# EAGLE design GBP USB-C Charging Kit (EAGLE 6.2)
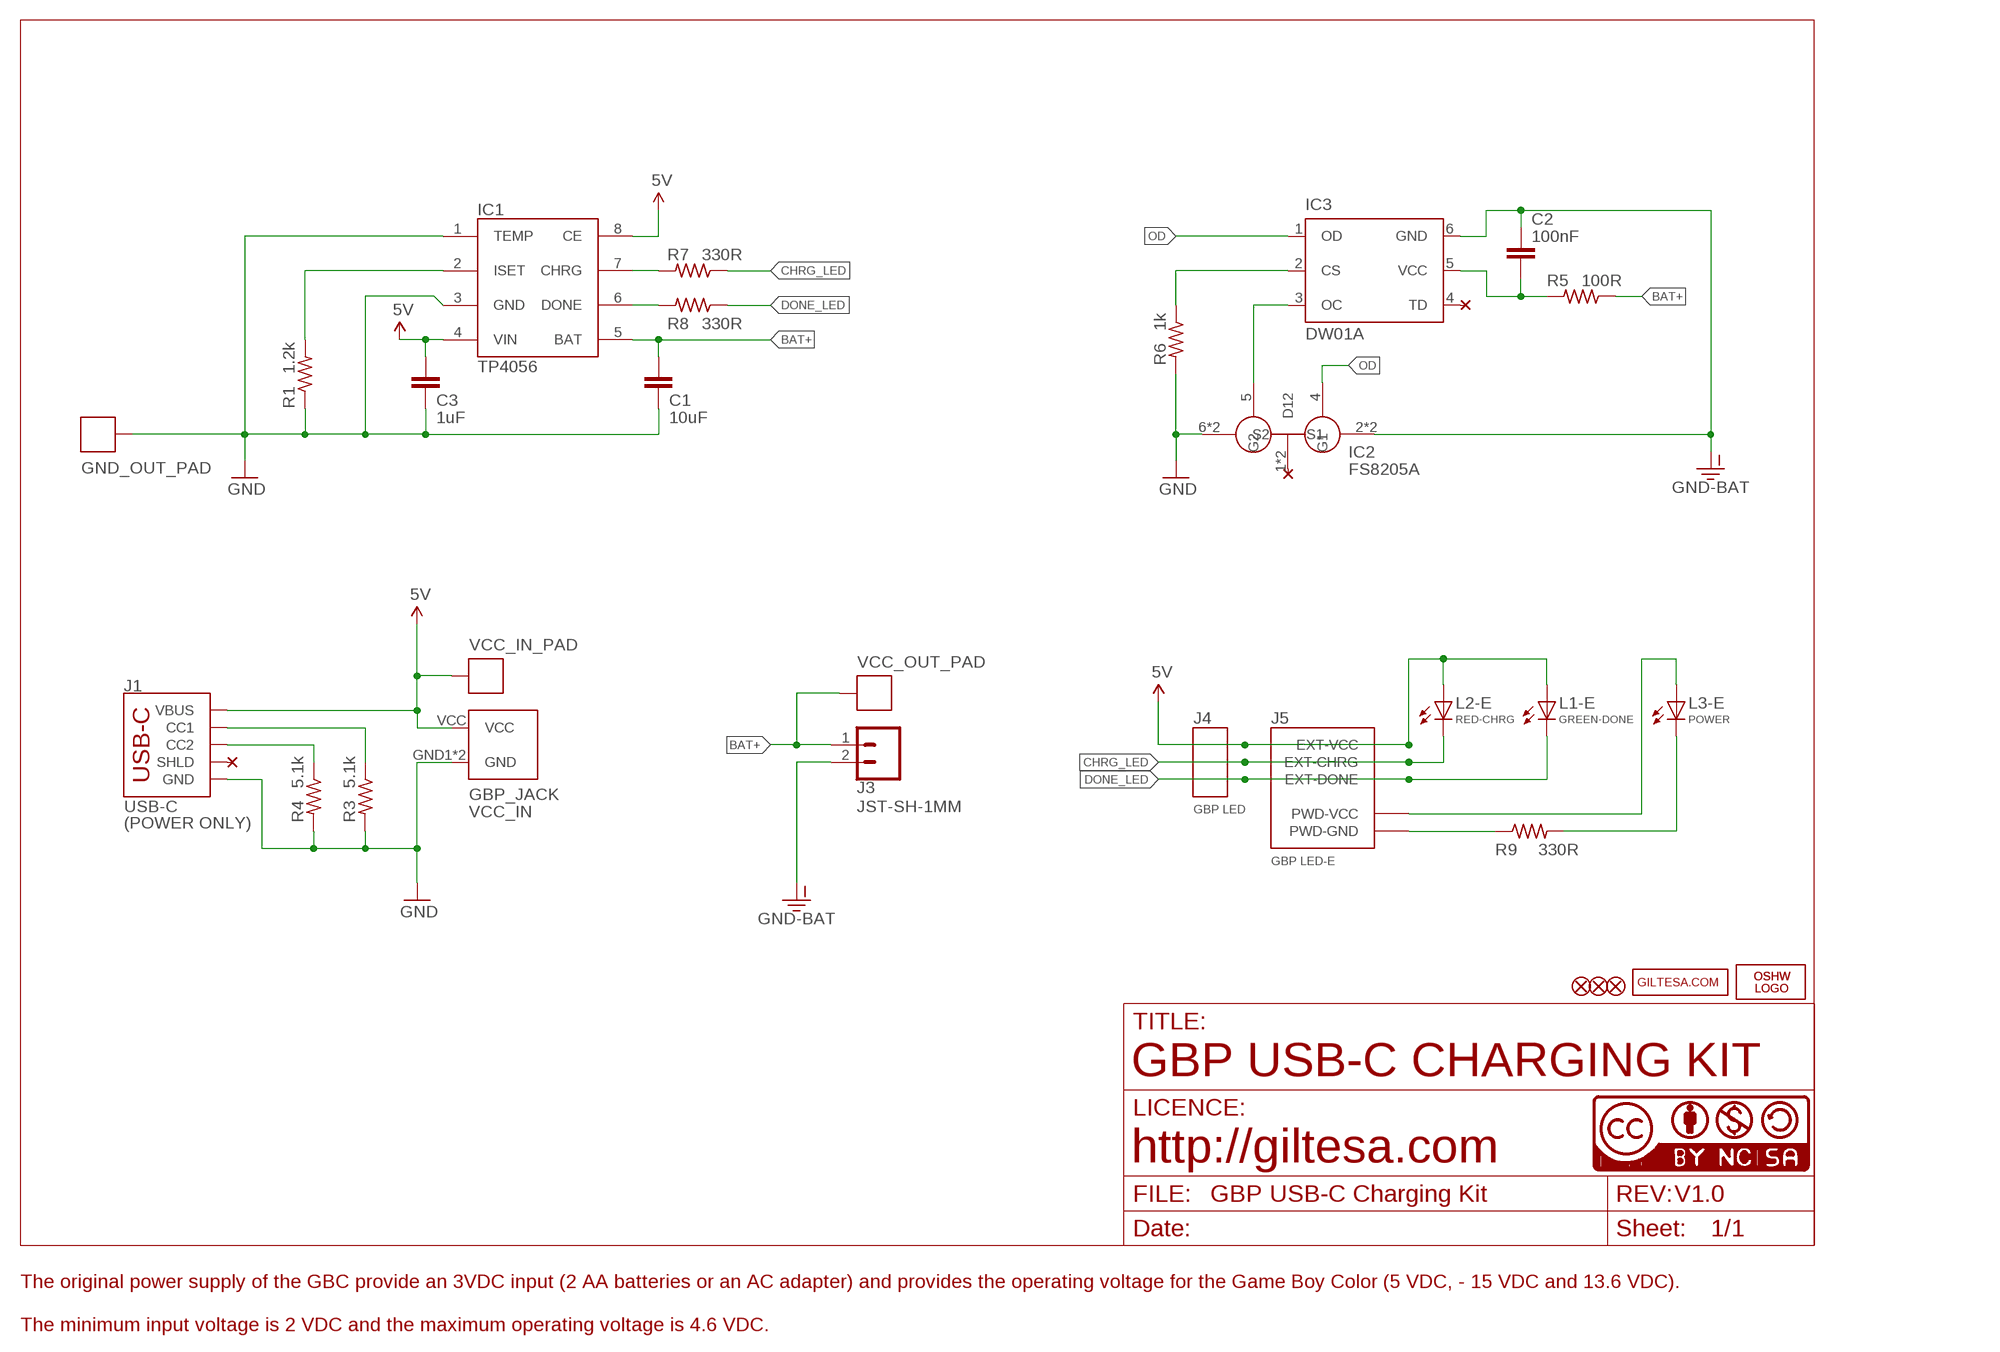
[diagram p0: schematic, sheet 1]

## Parts
C1  10uF  C0805  [C0805]
C2  100nF  C0603  [C0603]
C3  1uF  C0603  [C0603]
FD2  FIDUCIALUFIDUCIAL  [FIDUCIAL-MICRO]
FD3  FIDUCIALUFIDUCIAL  [FIDUCIAL-MICRO]
FD4  FIDUCIALUFIDUCIAL  [FIDUCIAL-MICRO]
GBP_JACK  VCC_IN  GBP_POWER_JACK  [GBP_POWER_JACK]
GND_OUT_PAD  1X01_SMT_1.8MM_2  [1X01_SMT_1.8MM_2]
IC1  TP4056  DIO5158  [SOIC-8]
IC2  8205A  FS8205A  [TSSOP8]
IC3  DW01A  DW01-P  [SOT23-6L]
J1  USB-C  USB-CPOWER  [USB-C_6P]
J3  JST-SH-1MM  JST-21MM  [JST-2-1MM-SMD_RIGHT]
J4  GBP LED  1X032  [1X03_SMD_2]
J5  GBP LED-E  GBP_LED  [GBP_LED]
L1-E  GREEN-DONE  L0402  [L0402]
L2-E  RED-CHRG  L0402  [L0402]
L3-E  POWER  L0402  [L0402]
LOGO1  OSHW_LOGO_FILLX0150-NT  [OSHW_FILLX150_NOTEXT]
LOGO2  OSHW_LOGO_FILLX0150-NT  [OSHW_FILLX150_NOTEXT]
R1  1.2k  R0402  [R0402]
R3  5.1k  R0402  [R0402]
R4  5.1k  R0402  [R0402]
R5  100R  R0402  [R0402]
R6  1k  R0402  [R0402]
R7  330R  R0402  [R0402]
R8  330R  R0402  [R0402]
R9  330R  R0402  [R0402]
U$6  CC-BY-NC-SA15MM  [CC-BY-NC-SA_15MM]
U$16  GILTESA.COM_MASK  [GILTESA.COM_MASK]
U$17  CC-NC-BCNIX  [CC-NC-B_NIX]
VCC_IN_PAD  1X01_SMT_1.8MM_3  [1X01_SMT_1.8MM_3]
VCC_OUT_PAD  1X01_SMT_1.8MM_3  [1X01_SMT_1.8MM_3]

## Nets
5V: C3.1 GBP_JACK.VCC IC1.4(VIN) IC1.8(CE) J1.VBUS1(VBUS) J1.VBUS2(VBUS) J4.3 J5.EXT-VCC L1-E.A L2-E.A VCC_IN_PAD.P$1
BAT+: C1.1 IC1.5(BAT) J3.1 R5.1 VCC_OUT_PAD.P$1
CHRG: IC1.7(CHRG) R7.2
CHRG_LED: J4.2 J5.EXT-CHRG L2-E.C R7.1
DONE: IC1.6(DONE) R8.2
DONE_LED: J4.1 J5.EXT-DONE L1-E.C R8.1
GND: C1.2 C3.2 GBP_JACK.GND1(GND) GBP_JACK.GND2(GND) GND_OUT_PAD.P$1 IC1.1(TEMP) IC1.3(GND) IC2.6(S2) IC2.7(S2) J1.GND1(GND) J1.GND2(GND) R1.1 R3.2 R4.2 R6.2
GND-BAT: C2.1 IC2.2(S1) IC2.3(S1) IC3.6(GND) J3.2
ISET: IC1.2(ISET) R1.2
N$1: IC3.2(CS) R6.1
N$2: IC2.5(G2) IC3.3(OC)
N$4: J1.A5(CC1) R3.1
N$6: J1.B5(CC2) R4.1
N$11: L3-E.C R9.2
OD: IC2.4(G1) IC3.1(OD)
PWD-GND: J5.PWD-GND J5.PWD-GND'(PWD-GND) R9.1
PWD-VCC: J5.PWD-VCC J5.PWD-VCC'(PWD-VCC) L3-E.A
VCC-DW: C2.2 IC3.5(VCC) R5.2
Unconnected: IC2.1(D12) IC2.8(D12) IC3.4(TD) J1.SHLD1(SHLD) J1.SHLD2(SHLD) J1.SHLD3(SHLD) J1.SHLD4(SHLD) J1.SHLD5(SHLD) J1.SHLD6(SHLD) J1.SHLD7(SHLD) J1.SHLD8(SHLD)

## Notes on the sheet
- IC2
- FS8205A
- (POWER ONLY)
- GBP USB-C CHARGING KIT
- http://giltesa.com
- V1.0
- The original power supply of the GBC provide an 3VDC input (2 AA batteries or an AC adapter) and provides the operating voltage for the Game Boy Color (5 VDC, - 15 VDC and 13.6 VDC).
- The minimum input voltage is 2 VDC and the maximum operating voltage is 4.6 VDC.

## Library data of the parts
C1 = ,giltesa:C0805
C2 C3 = ,giltesa:C0603
FD2-FD4 = SparkFun-Aesthetics:FIDUCIAL: Fiducial Alignment Points Point-of-reference for pick-and-place machines and other optical instruments.
GBP_JACK = ,giltesa:GBP_POWER_JACK
GND_OUT_PAD VCC_IN_PAD VCC_OUT_PAD = ,giltesa:1X01
IC1 = ERADIONICA:DIO5158
IC2 = SparkFun:FS8205A
IC3 = lipo:DW01-P: One Cell Lithium-ion/Polymer Battery Protection IC The DW01-P battery protection IC is designed to protect lithium-ion/polymer battery from damage or degrading the lifetime due to overcharge, overdischarge, and/or overcurrent for one-cell lithium-ion/polymer battery powered systems, such as cellular phones. The ultra-small package and less required external components make it ideal to integrate the DW01-P into the limited space of battery pack. The accurate ±50mV overcharging detection voltage ensures safe and full utilization charging. The very low standby current drains little current from the cell while in storage.
J1 = ,giltesa:USB-C
J3 = ,giltesa:JST-2
J4 = ,giltesa:1X03
J5 = ,giltesa:GBP_LED
L1-E L2-E L3-E = ,giltesa:L0402
LOGO1 LOGO2 = ohw-logo:OSHW_LOGO_FILL
R1 R3-R9 = ,giltesa:R0402
U$6 = ,giltesa_logos:CC-BY-NC-SA
U$16 = ,giltesa_logos:GILTESA.COM
U$17 = cc-by-nc-sa:CC-NC-BC: All hardware is licensed under the Creative Commons Attribution-Noncommercial-Share Alike 2.5 Switzerland License. To view a copy of this license, visit http://creativecommons.org/licenses/by-nc-sa/2.5/ch/ or send a letter to Creative Commons, 171 Second Street, Suite 300, San Francisco, California, 94105, USA.

## Net classes
1 power: width 0.61 mm, drill 0.406 mm, clearance 0.203 mm
2 gnd: width 0.305 mm, drill 0.406 mm, clearance 0.203 mm
3 power usb: width 0.508 mm, drill 0.406 mm, clearance 0.203 mm

## Board
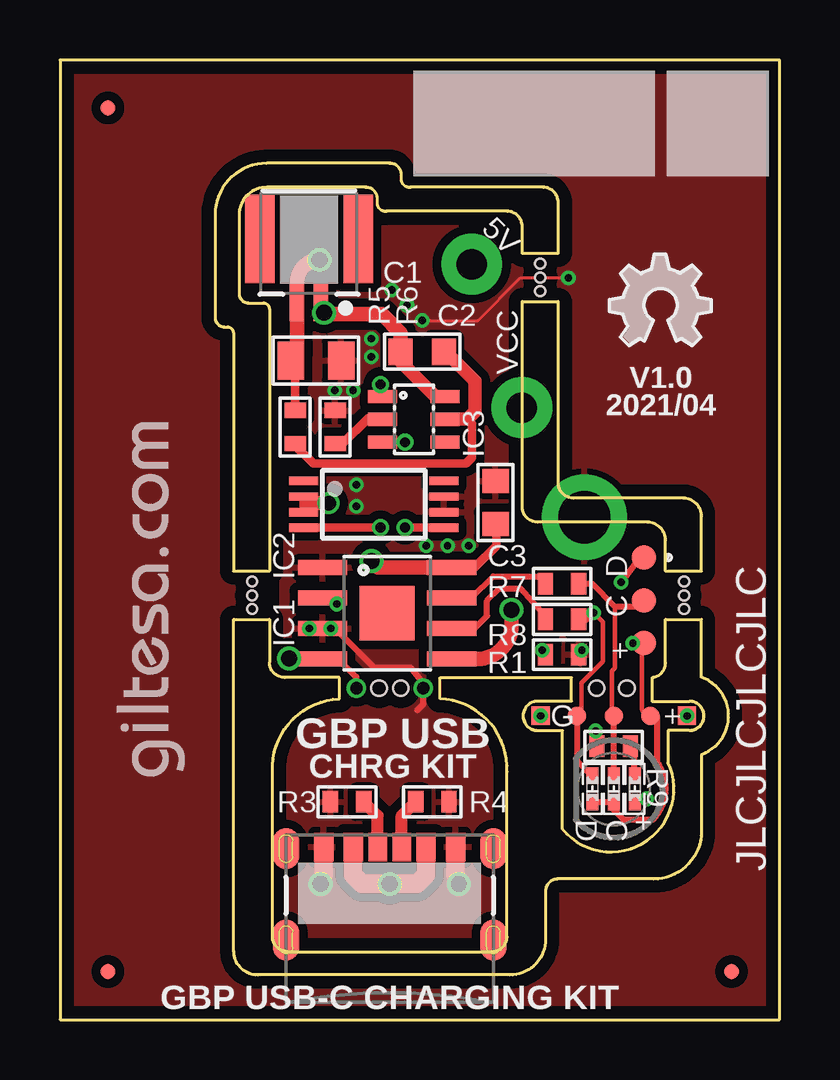
[diagram p1: board, top side]
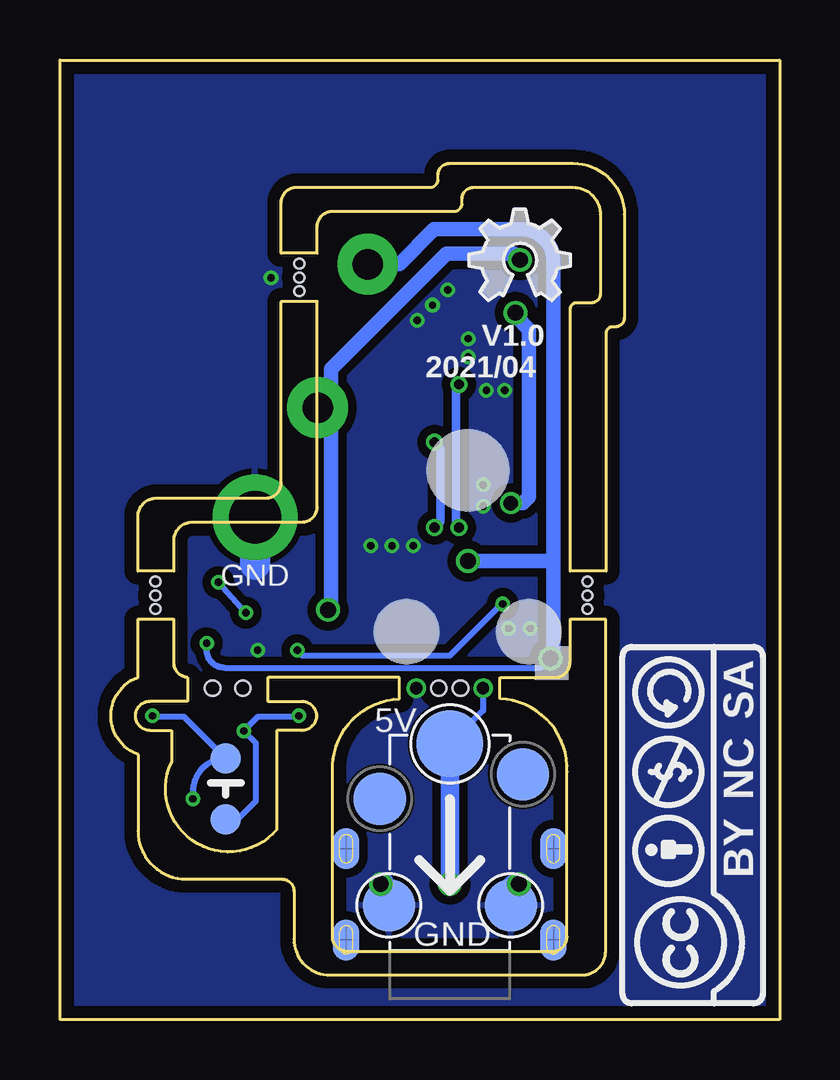
[diagram p2: board, bottom side, seen from below]

Size 30 x 40 mm. Coordinates in mm from the lower left corner, seen from the top.
Outline: 24.68,14.26 24.68,13.27 26.24,13.27 arc-180 26.24,12.05 25.35,12.05 25.35,10.73 arc-165 20.95,7.93 20.95,12.05 19.92,12.05 arc-180 19.92,13.27 21.33,13.27 21.33,14.26 15.85,14.26 15.85,13.37 arc-90 18.64,10.32 18.64,3.46 arc-90 18,2.83 9.5,2.83 arc-90 8.86,3.46 8.86,10.32 arc-90 11.65,13.37 11.65,14.26 9.37,14.26 arc-90 8.73,14.89 8.73,16.68 7.25,16.68 7.25,2.86 arc90 8.25,1.86 18.75,1.86 arc90 20.25,3.36 20.25,5.36 arc-90 20.75,5.86 24.75,5.86 arc90 26.75,7.86 26.75,11.05 arc140 26.75,14.27 26.74,16.68 25.24,16.68 25.24,14.89 arc-90 24.68,14.26
Outline: 0,0 30,0 30,40 0,40 0,0
Outline: 25.24,18.69 25.24,19.97 arc90 24.48,20.74 19.91,20.74 arc-90 19.27,21.37 19.27,29.93 20.77,29.93 20.77,22.37 arc90 21.41,21.74 25.98,21.74 arc-90 26.74,20.97 26.74,18.69 25.24,18.69
Outline: 19.27,31.94 19.27,33.06 arc90 18.64,33.69 13.62,33.69 arc-90 13.24,33.97 13.24,34.22 arc90 12.73,34.69 8.61,34.69 arc90 7.47,33.56 7.47,30.25 arc90 7.85,29.87 8.48,29.87 arc-90 8.73,29.62 8.73,18.69 7.23,18.69 7.23,28.62 arc90 6.98,28.87 6.85,28.87 arc-90 6.47,29.25 6.47,33.56 arc-90 8.61,35.69 13.73,35.69 arc-90 14.24,35.22 14.24,34.97 arc90 14.62,34.69 20.14,34.69 arc-90 20.77,34.06 20.77,31.94 19.27,31.94
Copper layers (1*16): Top 0.035mm / dielectric 1.6mm / Bottom 0.035mm
Design rules: minimum track width 6mil, minimum drill 12mil, track to track 6mil, track to pad 6mil, pad to pad 6mil, via to via 8mil, smd to smd 0mil, copper to edge 20mil, drill to drill 10mil, minimum pad ring 6mil, minimum via ring 6mil, stop-mask expansion 0mil, vias tented up to drill 100mil, thermal gap 10mil
Holes 0.64 mm at 13.3,13.82 14.2,13.82 22.38,13.82 23.63,13.82
Holes 0.41 mm at 20.02,31.5 20.02,30.36 20.02,30.93 26.02,18.25 26.02,17.11 26.02,17.68 8.01,18.25 8.01,17.11 8.01,17.68
tRestrict: area 8.4,16.7 to 8.8,18.6
bRestrict: area 25,16.7 to 25.4,18.6

### Footprints (pad centres in the part's own frame; a part is rotated, then mirrored left to right if it is on the bottom)
C0805 = smd 1.1 x 1.6: 1 -1.05,0; 2 1.05,0
C0603 = smd 1 x 1.1: 1 -0.901,0; 2 0.901,0
FIDUCIAL-MICRO = smd 0.635 x 0.635: 1 0,0
GBP_POWER_JACK = smd 2.2 x 2.2 bottom: GND1 -2.54,1.905; GND2 2.54,1.905; NC1 -3.048,7.366; NC2 2.921,6.35 | smd 2.8 x 2.8 bottom: VCC 0,8.636
1X01_SMT_1.8MM_2 = drill 2.184 pad 3.556: P$1 0,0
SOIC-8 = smd 0.61 x 2.057: 1 -2.07,-2.892; 2 -0.8,-2.892; 3 0.47,-2.892; 4 1.74,-2.892; 5 1.74,2.492; 6 0.47,2.492; 7 -0.8,2.492; 8 -2.07,2.492 | smd 2.286 x 2.286: EPAD -0.165,-0.2
TSSOP8 = smd 1.2 x 0.35: 1 -2.925,0.975; 2 -2.925,0.325; 3 -2.925,-0.325; 4 -2.925,-0.975; 5 2.925,-0.975; 6 2.925,-0.325; 7 2.925,0.325; 8 2.925,0.975
SOT23-6L = smd 0.55 x 1.2: 1 -0.95,-1.3; 2 0,-1.3; 3 0.95,-1.3; 4 0.95,1.3; 5 0,1.3; 6 -0.95,1.3
USB-C_6P = smd 0.76 x 1.2: A5 -0.5,-0.08; B5 0.5,-0.08 | smd 0.8 x 1.2: GND1 -2.75,-0.08; GND2 2.75,-0.08; VBUS1 -1.52,-0.08; VBUS2 1.52,-0.08 | smd 1.1 x 1.7: SHLD1 -4.32,-0.15; SHLD2 4.32,-0.15; SHLD5 -4.32,-3.95; SHLD8 4.32,-3.95 | smd 1.1 x 1.7 bottom: SHLD3 -4.32,-0.15; SHLD4 4.32,-0.15; SHLD6 -4.32,-3.95; SHLD7 4.32,-3.95
JST-2-1MM-SMD_RIGHT = smd 0.6 x 1.524: 1 -0.5,-2.017; 2 0.5,-2.017 | smd 1.219 x 3.683: NC1 -2.054,0.635; NC2 2.054,0.635
1X03_SMD_2 = smd 1.016 x 1.016: 1 0,-1.778; 2 0,0; 3 0,1.778
GBP_LED = smd 0.762 x 0.762: EXT-CHRG -3.048,0; EXT-DONE -3.048,-1.524; EXT-VCC -3.048,1.524; PWD-GND' -3.048,-3.048; PWD-VCC' -3.048,3.048 | smd 1.27 x 1.27 bottom: PWD-GND 1.27,0; PWD-VCC -1.27,0
L0402 = smd 0.7 x 0.5: A -0.55,0; C 0.55,0
R0402 = smd 0.635 x 0.9: 1 -0.694,0; 2 0.694,0
1X01_SMT_1.8MM_3 = drill 1.27 pad 2.54: P$1 0,0

### Placement (x,y rotation side)
C1  10.67,27.47 0 top
C2  15.1,27.84 0 top
C3  18.16,21.55 90 top
FD2  28,2 0 top
FD3  2,2 0 top
FD4  2,38 0 top
GBP_JACK  13.75,2.86 0 top
GND_OUT_PAD  21.87,20.94 0 top
IC1  13.84,16.77 270 top
IC2  13.08,21.48 0 top
IC3  14.75,25.02 270 top
J1  13.75,7.27 0 top
J3  10.38,31.9 0 top
J4  24.35,17.48 180 top
J5  23.09,9.61 270 top
L1-E  22.2,9.61 90 top
L2-E  23.09,9.61 90 top
L3-E  23.97,9.61 90 top
LOGO1  12.95,29.98 0 bottom
LOGO2  22.91,28.09 0 top
R1  20.93,15.21 180 top
R3  11.97,9.08 180 top
R4  15.52,9.08 0 top
R5  9.81,24.7 270 top
R6  11.47,24.7 90 top
R7  20.93,18.17 180 top
R8  20.93,16.68 180 top
R9  23.09,11.39 0 top
U$6  0.57,0.55 90 bottom
U$16  5.28,10.04 90 top
U$17  13.75,2.86 0 top
VCC_IN_PAD  17.17,31.48 0 top
VCC_OUT_PAD  19.26,25.51 0 top

### Tracks (layer width: path | path; a pad name or v marks a point on that pad's centre or on a via)
5V  (via drill 0.3, 0.51, 0.66)
  Top 0.178: J5.EXT-VCC arc-91 24.26,13 24.26,15.62 arc-90 J4.3
  Top 0.254: 22.18,9.07 22.26,9.07 | 22.26,9.07 23.07,9.07 | 23.07,9.07 23.07,8.76 23.48,8.35 24.75,8.35 arc80 24.88,10.76 24.88,12.67 24.62,12.67 J5.EXT-VCC | L1-E.A 22.25,9.06 22.26,9.07 | L2-E.A 23.07,9.07 | IC1.4 11.73,15.03 11.73,14.91 12.35,14.29 12.35,13.83 v12.36,13.82 | J4.3 arc90 J4.3 arc-90 J4.3 | v23.88,15.69 J4.3
  Top 0.356: IC1.8 17.29,18.84 18.19,19.75 18.19,20.62 C3.1
  Top 0.61: v9.55,15.05 10.94,15.05 IC1.4 | IC1.8 13.25,18.84 v12.98,19.11
  Top 0.762: J1.VBUS1 12.23,6.03 12.6,5.65 v13.75,5.65 14.89,5.65 15.27,6.03 J1.VBUS2
  Bottom 0.254: v9.55,15.05 9.94,14.67 23.14,14.67 arc90 23.88,15.4 v23.88,15.69 | GBP_JACK.VCC 12.36,12.88 v12.36,13.82
  Bottom 0.61: 9.43,19.11 9.43,15.17 arc90 v9.55,15.05 | v12.98,19.11 9.43,19.11 | VCC_IN_PAD.P$1 15.85,31.48 14.4,32.94 10.83,32.94 arc90 9.43,31.67 9.43,19.11
  Bottom 0.762: v13.75,5.65 GBP_JACK.VCC
BAT+  (via drill 0.66)
  Top 0.356: R5.1 9.81,27.28 C1.1
  Top 0.61: v18.83,17.08 18.83,16.44 arc-90 17.41,15.03 IC1.5 | v10.83,31.67 arc90 9.88,30.73 J3.1 9.88,27.73 C1.1
  Bottom 0.61: 18.7,25.59 18.7,27.11 13.89,31.92 11.08,31.92 v10.83,31.67 | VCC_OUT_PAD.P$1 18.78,25.51 18.7,25.59 | 18.7,25.59 18.7,17.21 arc90 v18.83,17.08
CHRG
  Top 0.254: R7.2 20.17,18.17 20.1,18.1 | IC1.7 17.16,17.57 18.06,18.48 19.94,18.48 R7.2 | 20.06,18.35 R7.2
CHRG_LED
  Top 0.178: J5.EXT-CHRG 23.09,12.75 23.01,12.83 23.01,14.53 23.14,14.67 23.14,17.21
  Top 0.254: L2-E.C 23.07,10.17 23.07,12.67 J5.EXT-CHRG | J4.2 24.35,17.39 24.16,17.21 23.14,17.21 22.18,18.17 R7.1
DONE
  Top 0.254: IC1.6 17.29,16.3 17.81,16.83 17.81,17.46 18.32,17.97 19.21,17.97 20.24,16.81 R8.2
DONE_LED  (via drill 0.3)
  Top 0.178: 21.54,12.67 21.54,12.86 21.51,12.89 21.75,12.88 21.75,14.03 22.64,14.92 22.64,16.57 v22.26,16.95
  Top 0.254: L1-E.C 21.54,10.81 21.54,12.67 21.55,12.66 J5.EXT-DONE | J4.1 24.16,19.24 v23.4,18.22 | R8.1 21.99,16.68 v22.26,16.95
  Bottom 0.254: v22.26,16.95 v23.4,18.22
GND  (via drill 0.3, 0.51, 0.66)
  Top 0.127: v15.1,29.14 17.43,29.14 19.21,30.92 v21.2,30.92
  Top 0.254: 14.89,12.89 15.14,13.14 v15.14,13.82 15.14,14.03 14.63,14.67 13.11,14.67 11.48,16.3 | R1.1 21.63,15.26 v21.76,15.39
  Top 0.762: J1.GND1 11,6.03 v10.87,5.65 | J1.GND2 16.5,6.03 v16.62,5.65
  Bottom 0.762: GBP_JACK.GND2 16.48,4.95 16.48,5.76 v16.62,5.65 | GBP_JACK.GND1 11.15,4.82 11.15,5.63 v10.87,5.65
  Bottom 1.27: GND_OUT_PAD.P$1 21.87,18.98
  other vias: 10.4,16.3 11.29,16.3 17.05,19.75 16.16,19.75 15.27,19.75 12.35,22.29 12.35,21.4 12.98,28.38 12.98,27.62 11.46,26.22 12.22,26.22 14.47,29.78 13.83,30.41
  pour Top (isolate 0.356): -0.48,40.45 30.51,40.45 30.51,-0.45 -0.48,-0.45
  pour Bottom (isolate 0.356): -0.48,40.45 30.51,40.45 30.51,-0.45 -0.48,-0.45
GND-BAT  (via drill 0.61, 0.66)
  Top 0.356: 10.57,21.52 10.44,21.52 IC2.2 IC2.3
  Top 0.559: IC3.6 15.65,25.97 14.25,27.37 14.25,27.79 C2.1
  Top 0.61: J3.2 10.88,29.47 v11.02,29.46 11.08,29.4 13.43,29.4 14.2,28.62 C2.1 | v11.21,21.52 10.57,21.52
  Bottom 0.61: v11.02,29.46 10.95,29.27 10.44,28.76 10.44,21.78 10.7,21.52 v11.21,21.52
ISET  (via drill 0.3)
  Top 0.254: IC1.2 11.28,17.57 v11.54,17.32 | R1.2 20.04,15.21 v20.11,15.39
  Bottom 0.254: v11.54,17.32 11.6,17.32 13.75,15.17 19.89,15.17 v20.11,15.39
N$1
  Top 0.356: R6.1 11.78,24.01 12.86,25.08 13.24,25.08 13.3,25.02 IC3.2
N$2  (via drill 0.41)
  Top 0.356: IC2.5 v14.39,20.5 v14.38,20.51 | v14.38,24.06 13.46,24.06 IC3.3
  Bottom 0.356: v14.38,20.51 14.13,20.76 14.13,23.81 v14.38,24.06
N$4
  Top 0.508: J1.A5 13.25,8.49 R3.1
N$6
  Top 0.508: J1.B5 14.25,8.49 R4.1
N$11
  Top 0.254: 23.78,11.38 23.96,11.2 23.96,10.17 23.96,10.16 L3-E.C | 23.78,11.38 23.76,11.4 | R9.2 23.78,11.38
OD  (via drill 0.41)
  Top 0.356: IC2.4 v13.36,20.5 v13.37,20.51 | v13.37,26.48 13.37,26.06 IC3.1
  Bottom 0.356: v13.37,20.51 13.37,20.64 13.49,20.76 13.49,26.35 v13.37,26.48
PWD-GND  (via drill 0.3)
  Top 0.254: v22.34,12.03 22.34,11.43 R9.1 | J5.PWD-GND' 20.07,12.66 v20.05,12.66
  Bottom 0.254: J5.PWD-GND 22.59,8.35 21.83,9.11 21.83,11.53 v22.34,12.03 21.74,12.63 20.07,12.63 v20.05,12.66
PWD-VCC  (via drill 0.3)
  Top 0.254: v24.45,9.2 24.08,9.2 arc90 23.96,9.07 23.96,9.06 L3-E.A | J5.PWD-VCC' 26.22,12.66 J5.PWD-VCC'
  Bottom 0.254: v24.45,9.2 24.45,9.5 arc90 23.07,10.89 J5.PWD-VCC 24.84,12.63 26.12,12.63 J5.PWD-VCC'
  other vias: 26.14,12.66
VCC-DW
  Top 0.356: R5.2 9.81,23.94 10.57,23.18 16.92,23.18 17.18,23.43 17.18,24.84 16.99,25.02
  Top 0.559: C2.2 16.07,27.84 17.3,26.6 17.3,25.33 16.99,25.02 IC3.5

### Text on the board
tPlace: 5V | VCC | V1.0 | 2021/04 | D | C | + | G | + | JLCJLCJLCJLC | GBP USB | CHRG KIT | + | D | C | GBP USB-C CHARGING KIT
bPlace: V1.0 | 2021/04 | GND | 5V | GND